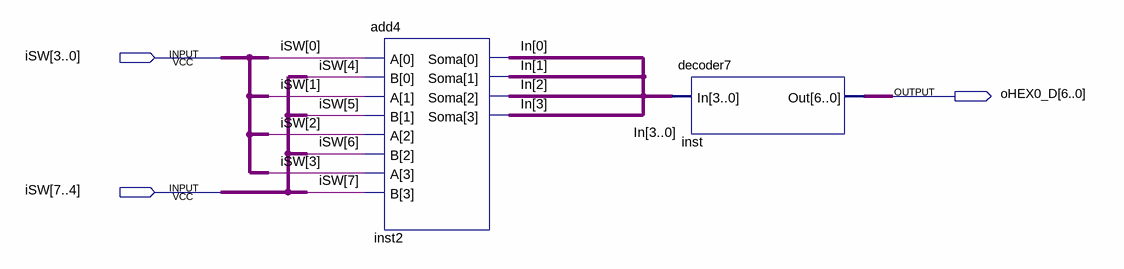
[diagram p0: schematic sheet]
// Quartus schematic teste.bdf as structural Verilog: 2 symbols, 3 pins
module teste (
  input  [7:0] iSW,
  output [6:0] oHEX0_D
);

  wire [3:0] In;

  add4 inst2 (.A(iSW[3:0]), .B(iSW[7:4]), .Soma(In));
  decoder7 inst (.In(In), .Out(oHEX0_D));
endmodule
